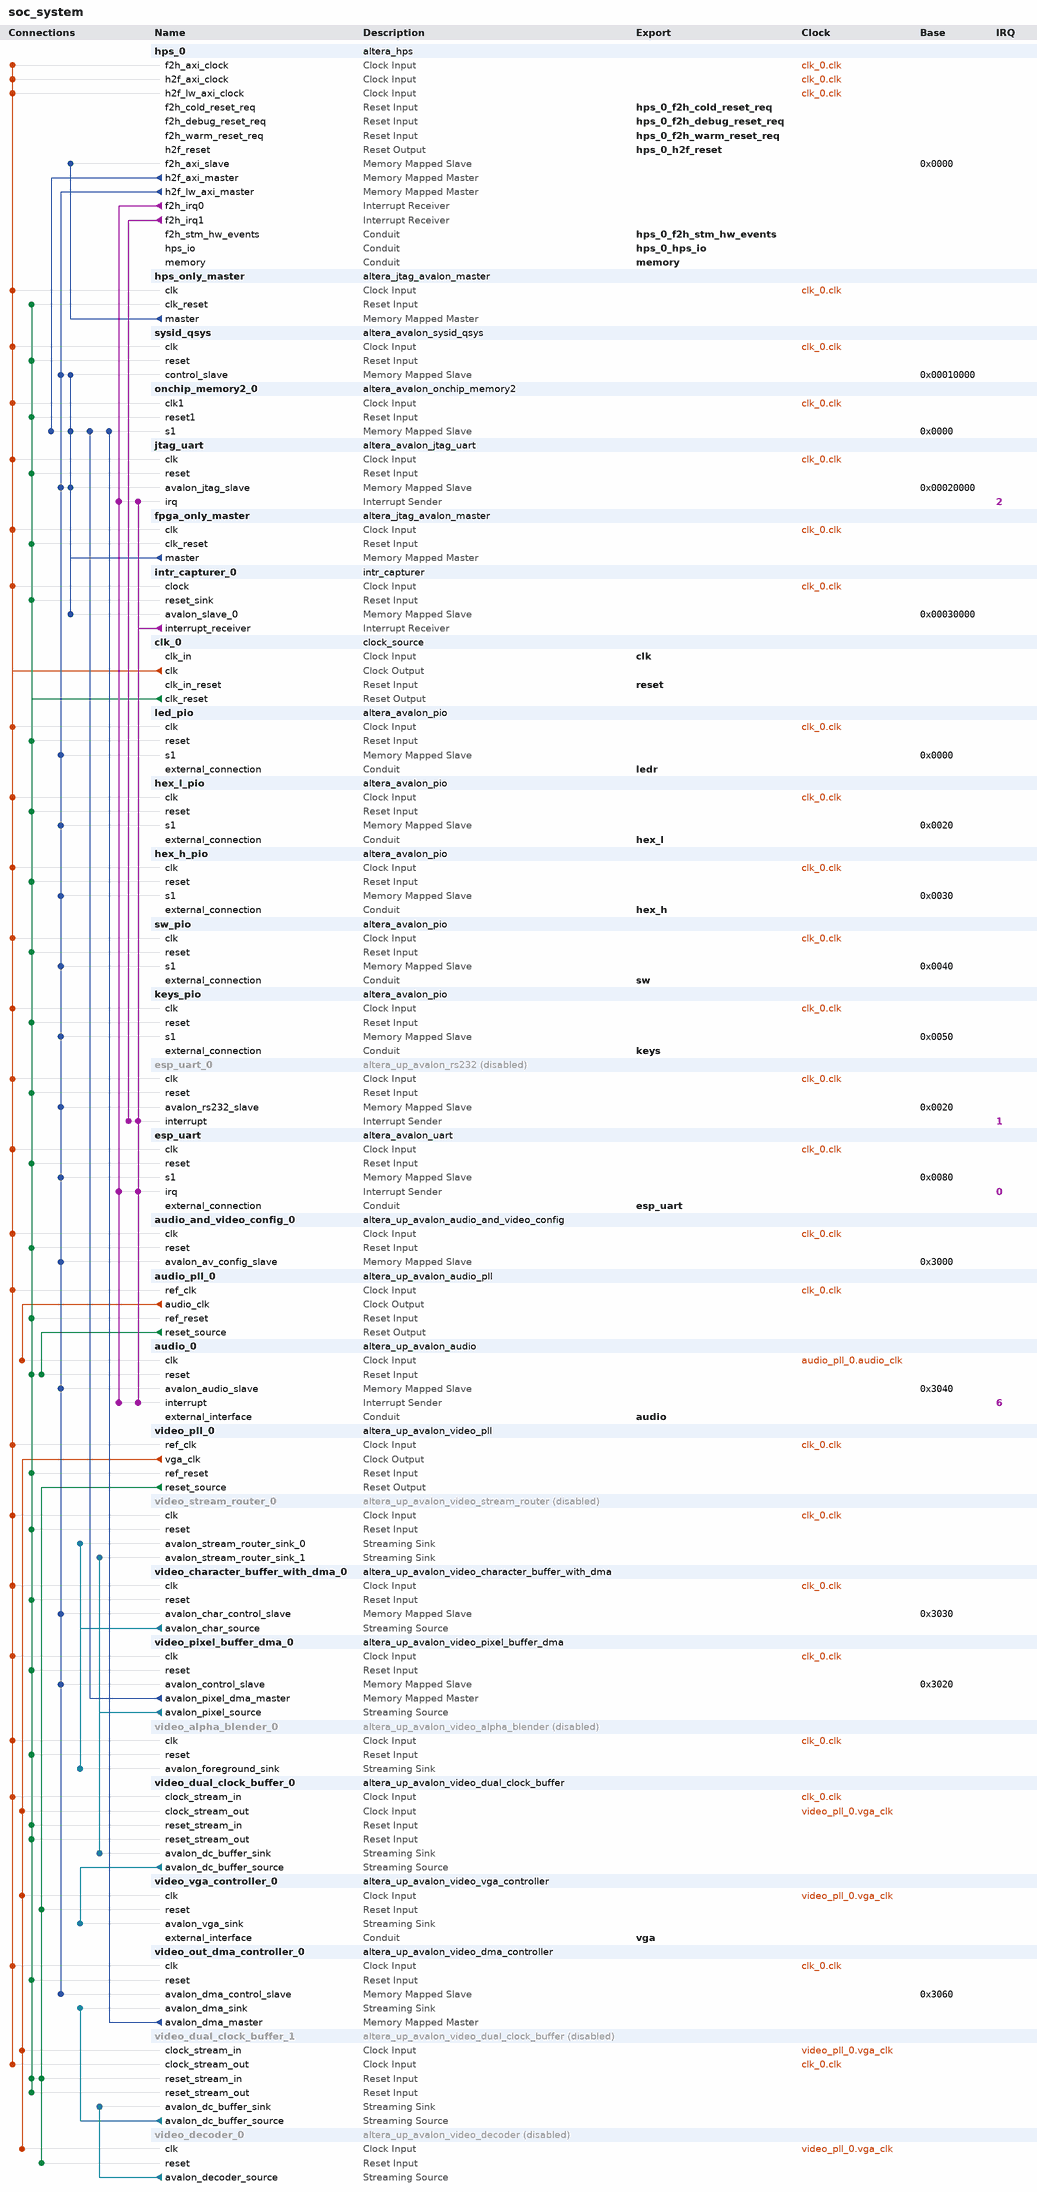
[diagram p0: system contents]
# Platform Designer (Qsys) system soc_system, Cyclone V 5CSEMA5F31C6
# Parameters at their usual value, and those the tool derives, are not listed.
package require -exact qsys 18.1
create_system soc_system
set_project_property DEVICE_FAMILY {Cyclone V}
set_project_property DEVICE 5CSEMA5F31C6

add_instance hps_0 altera_hps 18.1
set_instance_parameter_value hps_0 EMAC1_Mode RGMII
set_instance_parameter_value hps_0 EMAC1_PinMuxing {HPS I/O Set 0}
set_instance_parameter_value hps_0 F2SCLK_COLDRST_Enable true
set_instance_parameter_value hps_0 F2SCLK_DBGRST_Enable true
set_instance_parameter_value hps_0 F2SCLK_WARMRST_Enable true
set_instance_parameter_value hps_0 F2SINTERRUPT_Enable true
set_instance_parameter_value hps_0 F2S_Width 2
set_instance_parameter_value hps_0 FPGA_PERIPHERAL_OUTPUT_CLOCK_FREQ_EMAC0_GTX_CLK 100
set_instance_parameter_value hps_0 FPGA_PERIPHERAL_OUTPUT_CLOCK_FREQ_EMAC0_MD_CLK 100.0
set_instance_parameter_value hps_0 FPGA_PERIPHERAL_OUTPUT_CLOCK_FREQ_EMAC1_GTX_CLK 100
set_instance_parameter_value hps_0 FPGA_PERIPHERAL_OUTPUT_CLOCK_FREQ_EMAC1_MD_CLK 100.0
set_instance_parameter_value hps_0 HPS_PROTOCOL DDR3
set_instance_parameter_value hps_0 I2C0_Mode I2C
set_instance_parameter_value hps_0 I2C0_PinMuxing {HPS I/O Set 0}
set_instance_parameter_value hps_0 I2C1_Mode I2C
set_instance_parameter_value hps_0 I2C1_PinMuxing {HPS I/O Set 0}
set_instance_parameter_value hps_0 LWH2F_Enable true
set_instance_parameter_value hps_0 MEM_BANKADDR_WIDTH 3
set_instance_parameter_value hps_0 MEM_CLK_FREQ 400.0
set_instance_parameter_value hps_0 MEM_COL_ADDR_WIDTH 10
set_instance_parameter_value hps_0 MEM_DQ_WIDTH 32
set_instance_parameter_value hps_0 MEM_DRV_STR RZQ/7
set_instance_parameter_value hps_0 MEM_ROW_ADDR_WIDTH 15
set_instance_parameter_value hps_0 MEM_RTT_NOM RZQ/4
set_instance_parameter_value hps_0 MEM_RTT_WR RZQ/4
set_instance_parameter_value hps_0 MEM_TCL 11
set_instance_parameter_value hps_0 MEM_TFAW_NS 30.0
set_instance_parameter_value hps_0 MEM_TRAS_NS 35.0
set_instance_parameter_value hps_0 MEM_TRCD_NS 13.75
set_instance_parameter_value hps_0 MEM_TRFC_NS 260.0
set_instance_parameter_value hps_0 MEM_TRP_NS 13.75
set_instance_parameter_value hps_0 MEM_VENDOR JEDEC
set_instance_parameter_value hps_0 MEM_WTCL 8
set_instance_parameter_value hps_0 QSPI_Mode {1 SS}
set_instance_parameter_value hps_0 QSPI_PinMuxing {HPS I/O Set 0}
set_instance_parameter_value hps_0 REF_CLK_FREQ 25.0
set_instance_parameter_value hps_0 S2FCLK_USER2CLK 5
set_instance_parameter_value hps_0 S2F_Width 2
set_instance_parameter_value hps_0 SDIO_Mode {4-bit Data}
set_instance_parameter_value hps_0 SDIO_PinMuxing {HPS I/O Set 0}
set_instance_parameter_value hps_0 SPIM1_Mode {Single Slave Select}
set_instance_parameter_value hps_0 SPIM1_PinMuxing {HPS I/O Set 0}
set_instance_parameter_value hps_0 STM_Enable true
set_instance_parameter_value hps_0 TIMING_BOARD_AC_SKEW 0.03
set_instance_parameter_value hps_0 TIMING_BOARD_AC_TO_CK_SKEW 0.0
set_instance_parameter_value hps_0 TIMING_BOARD_DQ_TO_DQS_SKEW 0.0
set_instance_parameter_value hps_0 TIMING_BOARD_MAX_CK_DELAY 0.03
set_instance_parameter_value hps_0 TIMING_BOARD_MAX_DQS_DELAY 0.02
set_instance_parameter_value hps_0 TIMING_BOARD_SKEW_BETWEEN_DQS 0.08
set_instance_parameter_value hps_0 TIMING_BOARD_SKEW_CKDQS_DIMM_MAX 0.16
set_instance_parameter_value hps_0 TIMING_BOARD_SKEW_CKDQS_DIMM_MIN 0.09
set_instance_parameter_value hps_0 TIMING_BOARD_SKEW_WITHIN_DQS 0.01
set_instance_parameter_value hps_0 TIMING_TDH 65
set_instance_parameter_value hps_0 TIMING_TDQSCK 255
set_instance_parameter_value hps_0 TIMING_TDQSQ 125
set_instance_parameter_value hps_0 TIMING_TDS 30
set_instance_parameter_value hps_0 TIMING_TIH 140
set_instance_parameter_value hps_0 TIMING_TIS 180
set_instance_parameter_value hps_0 TIMING_TQSH 0.4
set_instance_parameter_value hps_0 UART0_Mode {No Flow Control}
set_instance_parameter_value hps_0 UART0_PinMuxing {HPS I/O Set 0}
set_instance_parameter_value hps_0 USB1_Mode SDR
set_instance_parameter_value hps_0 USB1_PinMuxing {HPS I/O Set 0}
set_instance_parameter_value hps_0 desired_cfg_clk_mhz 100.0
set_instance_parameter_value hps_0 desired_qspi_clk_mhz 400.0

add_instance hps_only_master altera_jtag_avalon_master 18.1

add_instance sysid_qsys altera_avalon_sysid_qsys 18.1
set_instance_parameter_value sysid_qsys id -1395322110

add_instance onchip_memory2_0 altera_avalon_onchip_memory2 18.1
set_instance_parameter_value onchip_memory2_0 dataWidth 64
set_instance_parameter_value onchip_memory2_0 dualPort false
set_instance_parameter_value onchip_memory2_0 initMemContent true
set_instance_parameter_value onchip_memory2_0 initializationFileName onchip_memory2_0
set_instance_parameter_value onchip_memory2_0 memorySize 65536

add_instance jtag_uart altera_avalon_jtag_uart 18.1
set_instance_parameter_value jtag_uart allowMultipleConnections true
set_instance_parameter_value jtag_uart simInteractiveOptions INTERACTIVE_ASCII_OUTPUT

add_instance fpga_only_master altera_jtag_avalon_master 18.1

add_instance intr_capturer_0 intr_capturer 100.99.98.97

add_instance clk_0 clock_source 18.1
set_instance_parameter_value clk_0 clockFrequency 50000000

add_instance led_pio altera_avalon_pio 18.1
set_instance_parameter_value led_pio direction Output
set_instance_parameter_value led_pio resetValue 15
set_instance_parameter_value led_pio width 10

add_instance hex_l_pio altera_avalon_pio 18.1
set_instance_parameter_value hex_l_pio direction Output
set_instance_parameter_value hex_l_pio width 21

add_instance hex_h_pio altera_avalon_pio 18.1
set_instance_parameter_value hex_h_pio direction Output
set_instance_parameter_value hex_h_pio width 21

add_instance sw_pio altera_avalon_pio 18.1
set_instance_parameter_value sw_pio bitClearingEdgeCapReg true
set_instance_parameter_value sw_pio captureEdge true
set_instance_parameter_value sw_pio direction Input
set_instance_parameter_value sw_pio edgeType ANY
set_instance_parameter_value sw_pio generateIRQ true
set_instance_parameter_value sw_pio irqType EDGE
set_instance_parameter_value sw_pio width 10

add_instance keys_pio altera_avalon_pio 18.1
set_instance_parameter_value keys_pio bitClearingEdgeCapReg true
set_instance_parameter_value keys_pio captureEdge true
set_instance_parameter_value keys_pio direction Input
set_instance_parameter_value keys_pio edgeType FALLING
set_instance_parameter_value keys_pio generateIRQ true
set_instance_parameter_value keys_pio irqType EDGE
set_instance_parameter_value keys_pio width 4

add_instance esp_uart_0 altera_up_avalon_rs232 17.1
set_instance_property esp_uart_0 ENABLED false
set_instance_parameter_value esp_uart_0 baud 115200
set_instance_parameter_value esp_uart_0 parity None

add_instance esp_uart altera_avalon_uart 18.1
set_instance_parameter_value esp_uart baud 115200
set_instance_parameter_value esp_uart dataBits 8
set_instance_parameter_value esp_uart fixedBaud true
set_instance_parameter_value esp_uart parity NONE
set_instance_parameter_value esp_uart stopBits 1

add_instance audio_and_video_config_0 altera_up_avalon_audio_and_video_config 18.0
set_instance_parameter_value audio_and_video_config_0 audio_in {Microphone to ADC}
set_instance_parameter_value audio_and_video_config_0 bit_length 24
set_instance_parameter_value audio_and_video_config_0 board DE1-SoC
set_instance_parameter_value audio_and_video_config_0 eai false
set_instance_parameter_value audio_and_video_config_0 line_in_bypass false
set_instance_parameter_value audio_and_video_config_0 sampling_rate {48 kHz}

add_instance audio_pll_0 altera_up_avalon_audio_pll 18.0
set_instance_parameter_value audio_pll_0 gui_refclk 50.0

add_instance audio_0 altera_up_avalon_audio 18.0
set_instance_parameter_value audio_0 audio_in false
set_instance_parameter_value audio_0 avalon_bus_type {Memory Mapped}
set_instance_parameter_value audio_0 dw 16

add_instance video_pll_0 altera_up_avalon_video_pll 18.0
set_instance_parameter_value video_pll_0 camera {5MP Digital Camera (THDB_D5M)}
set_instance_parameter_value video_pll_0 gui_refclk 50.0
set_instance_parameter_value video_pll_0 lcd {7" LCD on VEEK-MT and MTL/MTL2 Modules}

add_instance video_stream_router_0 altera_up_avalon_video_stream_router 18.0
set_instance_property video_stream_router_0 ENABLED false
set_instance_parameter_value video_stream_router_0 color_bits 8
set_instance_parameter_value video_stream_router_0 color_planes 1
set_instance_parameter_value video_stream_router_0 router_type Merge
set_instance_parameter_value video_stream_router_0 sync false

add_instance video_character_buffer_with_dma_0 altera_up_avalon_video_character_buffer_with_dma 18.0
set_instance_parameter_value video_character_buffer_with_dma_0 enable_transparency false

add_instance video_pixel_buffer_dma_0 altera_up_avalon_video_pixel_buffer_dma 18.0
set_instance_parameter_value video_pixel_buffer_dma_0 addr_mode X-Y
set_instance_parameter_value video_pixel_buffer_dma_0 back_start_address 0
set_instance_parameter_value video_pixel_buffer_dma_0 color_space {30-bit RGB}
set_instance_parameter_value video_pixel_buffer_dma_0 image_height 480
set_instance_parameter_value video_pixel_buffer_dma_0 image_width 640
set_instance_parameter_value video_pixel_buffer_dma_0 start_address 0

add_instance video_alpha_blender_0 altera_up_avalon_video_alpha_blender 18.0
set_instance_property video_alpha_blender_0 ENABLED false

add_instance video_dual_clock_buffer_0 altera_up_avalon_video_dual_clock_buffer 18.0
set_instance_parameter_value video_dual_clock_buffer_0 color_bits 10

add_instance video_vga_controller_0 altera_up_avalon_video_vga_controller 18.0
set_instance_parameter_value video_vga_controller_0 board DE1-SoC
set_instance_parameter_value video_vga_controller_0 resolution {VGA 640x480}

add_instance video_out_dma_controller_0 altera_up_avalon_video_dma_controller 18.0
set_instance_parameter_value video_out_dma_controller_0 addr_mode X-Y
set_instance_parameter_value video_out_dma_controller_0 back_start_address 0
set_instance_parameter_value video_out_dma_controller_0 color_bits 8
set_instance_parameter_value video_out_dma_controller_0 color_planes 3
set_instance_parameter_value video_out_dma_controller_0 dma_enabled true
set_instance_parameter_value video_out_dma_controller_0 height 240
set_instance_parameter_value video_out_dma_controller_0 mode {From Stream to Memory}
set_instance_parameter_value video_out_dma_controller_0 start_address 0
set_instance_parameter_value video_out_dma_controller_0 width 320

add_instance video_dual_clock_buffer_1 altera_up_avalon_video_dual_clock_buffer 18.0
set_instance_property video_dual_clock_buffer_1 ENABLED false
set_instance_parameter_value video_dual_clock_buffer_1 color_bits 8

add_instance video_decoder_0 altera_up_avalon_video_decoder 18.0
set_instance_property video_decoder_0 ENABLED false

# connections
add_connection audio_pll_0.audio_clk audio_0.clk clock
add_connection clk_0.clk audio_and_video_config_0.clk clock
add_connection clk_0.clk audio_pll_0.ref_clk clock
add_connection clk_0.clk esp_uart.clk clock
add_connection clk_0.clk esp_uart_0.clk clock
add_connection clk_0.clk fpga_only_master.clk clock
add_connection clk_0.clk hex_h_pio.clk clock
add_connection clk_0.clk hex_l_pio.clk clock
add_connection clk_0.clk hps_0.f2h_axi_clock clock
add_connection clk_0.clk hps_0.h2f_axi_clock clock
add_connection clk_0.clk hps_0.h2f_lw_axi_clock clock
add_connection clk_0.clk hps_only_master.clk clock
add_connection clk_0.clk intr_capturer_0.clock clock
add_connection clk_0.clk jtag_uart.clk clock
add_connection clk_0.clk keys_pio.clk clock
add_connection clk_0.clk led_pio.clk clock
add_connection clk_0.clk onchip_memory2_0.clk1 clock
add_connection clk_0.clk sw_pio.clk clock
add_connection clk_0.clk sysid_qsys.clk clock
add_connection clk_0.clk video_alpha_blender_0.clk clock
add_connection clk_0.clk video_character_buffer_with_dma_0.clk clock
add_connection clk_0.clk video_dual_clock_buffer_0.clock_stream_in clock
add_connection clk_0.clk video_dual_clock_buffer_1.clock_stream_out clock
add_connection clk_0.clk video_out_dma_controller_0.clk clock
add_connection clk_0.clk video_pixel_buffer_dma_0.clk clock
add_connection clk_0.clk video_pll_0.ref_clk clock
add_connection clk_0.clk video_stream_router_0.clk clock
add_connection video_pll_0.vga_clk video_decoder_0.clk clock
add_connection video_pll_0.vga_clk video_dual_clock_buffer_0.clock_stream_out clock
add_connection video_pll_0.vga_clk video_dual_clock_buffer_1.clock_stream_in clock
add_connection video_pll_0.vga_clk video_vga_controller_0.clk clock
add_connection audio_pll_0.reset_source audio_0.reset reset
add_connection clk_0.clk_reset audio_0.reset reset
add_connection clk_0.clk_reset audio_and_video_config_0.reset reset
add_connection clk_0.clk_reset audio_pll_0.ref_reset reset
add_connection clk_0.clk_reset esp_uart.reset reset
add_connection clk_0.clk_reset esp_uart_0.reset reset
add_connection clk_0.clk_reset fpga_only_master.clk_reset reset
add_connection clk_0.clk_reset hex_h_pio.reset reset
add_connection clk_0.clk_reset hex_l_pio.reset reset
add_connection clk_0.clk_reset hps_only_master.clk_reset reset
add_connection clk_0.clk_reset intr_capturer_0.reset_sink reset
add_connection clk_0.clk_reset jtag_uart.reset reset
add_connection clk_0.clk_reset keys_pio.reset reset
add_connection clk_0.clk_reset led_pio.reset reset
add_connection clk_0.clk_reset onchip_memory2_0.reset1 reset
add_connection clk_0.clk_reset sw_pio.reset reset
add_connection clk_0.clk_reset sysid_qsys.reset reset
add_connection clk_0.clk_reset video_alpha_blender_0.reset reset
add_connection clk_0.clk_reset video_character_buffer_with_dma_0.reset reset
add_connection clk_0.clk_reset video_dual_clock_buffer_0.reset_stream_in reset
add_connection clk_0.clk_reset video_dual_clock_buffer_0.reset_stream_out reset
add_connection clk_0.clk_reset video_dual_clock_buffer_1.reset_stream_in reset
add_connection clk_0.clk_reset video_dual_clock_buffer_1.reset_stream_out reset
add_connection clk_0.clk_reset video_out_dma_controller_0.reset reset
add_connection clk_0.clk_reset video_pixel_buffer_dma_0.reset reset
add_connection clk_0.clk_reset video_pll_0.ref_reset reset
add_connection clk_0.clk_reset video_stream_router_0.reset reset
add_connection video_pll_0.reset_source video_decoder_0.reset reset
add_connection video_pll_0.reset_source video_dual_clock_buffer_1.reset_stream_in reset
add_connection video_pll_0.reset_source video_vga_controller_0.reset reset
add_connection fpga_only_master.master intr_capturer_0.avalon_slave_0 avalon
set_connection_parameter_value fpga_only_master.master/intr_capturer_0.avalon_slave_0 baseAddress 0x00030000
add_connection fpga_only_master.master jtag_uart.avalon_jtag_slave avalon
set_connection_parameter_value fpga_only_master.master/jtag_uart.avalon_jtag_slave baseAddress 0x00020000
add_connection fpga_only_master.master onchip_memory2_0.s1 avalon
set_connection_parameter_value fpga_only_master.master/onchip_memory2_0.s1 baseAddress 0x0000
add_connection fpga_only_master.master sysid_qsys.control_slave avalon
set_connection_parameter_value fpga_only_master.master/sysid_qsys.control_slave baseAddress 0x00010000
add_connection hps_0.h2f_axi_master onchip_memory2_0.s1 avalon
set_connection_parameter_value hps_0.h2f_axi_master/onchip_memory2_0.s1 baseAddress 0x0000
add_connection hps_0.h2f_lw_axi_master audio_0.avalon_audio_slave avalon
set_connection_parameter_value hps_0.h2f_lw_axi_master/audio_0.avalon_audio_slave baseAddress 0x3040
add_connection hps_0.h2f_lw_axi_master audio_and_video_config_0.avalon_av_config_slave avalon
set_connection_parameter_value hps_0.h2f_lw_axi_master/audio_and_video_config_0.avalon_av_config_slave baseAddress 0x3000
add_connection hps_0.h2f_lw_axi_master esp_uart.s1 avalon
set_connection_parameter_value hps_0.h2f_lw_axi_master/esp_uart.s1 baseAddress 0x0080
add_connection hps_0.h2f_lw_axi_master esp_uart_0.avalon_rs232_slave avalon
set_connection_parameter_value hps_0.h2f_lw_axi_master/esp_uart_0.avalon_rs232_slave baseAddress 0x0020
add_connection hps_0.h2f_lw_axi_master hex_h_pio.s1 avalon
set_connection_parameter_value hps_0.h2f_lw_axi_master/hex_h_pio.s1 baseAddress 0x0030
add_connection hps_0.h2f_lw_axi_master hex_l_pio.s1 avalon
set_connection_parameter_value hps_0.h2f_lw_axi_master/hex_l_pio.s1 baseAddress 0x0020
add_connection hps_0.h2f_lw_axi_master jtag_uart.avalon_jtag_slave avalon
set_connection_parameter_value hps_0.h2f_lw_axi_master/jtag_uart.avalon_jtag_slave baseAddress 0x00020000
add_connection hps_0.h2f_lw_axi_master keys_pio.s1 avalon
set_connection_parameter_value hps_0.h2f_lw_axi_master/keys_pio.s1 baseAddress 0x0050
add_connection hps_0.h2f_lw_axi_master led_pio.s1 avalon
set_connection_parameter_value hps_0.h2f_lw_axi_master/led_pio.s1 baseAddress 0x0000
add_connection hps_0.h2f_lw_axi_master sw_pio.s1 avalon
set_connection_parameter_value hps_0.h2f_lw_axi_master/sw_pio.s1 baseAddress 0x0040
add_connection hps_0.h2f_lw_axi_master sysid_qsys.control_slave avalon
set_connection_parameter_value hps_0.h2f_lw_axi_master/sysid_qsys.control_slave baseAddress 0x00010000
add_connection hps_0.h2f_lw_axi_master video_character_buffer_with_dma_0.avalon_char_control_slave avalon
set_connection_parameter_value hps_0.h2f_lw_axi_master/video_character_buffer_with_dma_0.avalon_char_control_slave baseAddress 0x3030
add_connection hps_0.h2f_lw_axi_master video_out_dma_controller_0.avalon_dma_control_slave avalon
set_connection_parameter_value hps_0.h2f_lw_axi_master/video_out_dma_controller_0.avalon_dma_control_slave baseAddress 0x3060
add_connection hps_0.h2f_lw_axi_master video_pixel_buffer_dma_0.avalon_control_slave avalon
set_connection_parameter_value hps_0.h2f_lw_axi_master/video_pixel_buffer_dma_0.avalon_control_slave baseAddress 0x3020
add_connection hps_only_master.master hps_0.f2h_axi_slave avalon
set_connection_parameter_value hps_only_master.master/hps_0.f2h_axi_slave baseAddress 0x0000
add_connection video_out_dma_controller_0.avalon_dma_master onchip_memory2_0.s1 avalon
set_connection_parameter_value video_out_dma_controller_0.avalon_dma_master/onchip_memory2_0.s1 baseAddress 0x0000
add_connection video_pixel_buffer_dma_0.avalon_pixel_dma_master onchip_memory2_0.s1 avalon
set_connection_parameter_value video_pixel_buffer_dma_0.avalon_pixel_dma_master/onchip_memory2_0.s1 baseAddress 0x0000
add_connection video_character_buffer_with_dma_0.avalon_char_source video_alpha_blender_0.avalon_foreground_sink avalon_streaming
add_connection video_character_buffer_with_dma_0.avalon_char_source video_stream_router_0.avalon_stream_router_sink_0 avalon_streaming
add_connection video_decoder_0.avalon_decoder_source video_dual_clock_buffer_1.avalon_dc_buffer_sink avalon_streaming
add_connection video_dual_clock_buffer_0.avalon_dc_buffer_source video_vga_controller_0.avalon_vga_sink avalon_streaming
add_connection video_dual_clock_buffer_1.avalon_dc_buffer_source video_out_dma_controller_0.avalon_dma_sink avalon_streaming
add_connection video_pixel_buffer_dma_0.avalon_pixel_source video_dual_clock_buffer_0.avalon_dc_buffer_sink avalon_streaming
add_connection video_pixel_buffer_dma_0.avalon_pixel_source video_stream_router_0.avalon_stream_router_sink_1 avalon_streaming
add_connection hps_0.f2h_irq0 audio_0.interrupt interrupt
set_connection_parameter_value hps_0.f2h_irq0/audio_0.interrupt irqNumber 6
add_connection hps_0.f2h_irq0 esp_uart.irq interrupt
set_connection_parameter_value hps_0.f2h_irq0/esp_uart.irq irqNumber 0
add_connection hps_0.f2h_irq0 jtag_uart.irq interrupt
set_connection_parameter_value hps_0.f2h_irq0/jtag_uart.irq irqNumber 2
add_connection hps_0.f2h_irq1 esp_uart_0.interrupt interrupt
set_connection_parameter_value hps_0.f2h_irq1/esp_uart_0.interrupt irqNumber 1
add_connection intr_capturer_0.interrupt_receiver audio_0.interrupt interrupt
set_connection_parameter_value intr_capturer_0.interrupt_receiver/audio_0.interrupt irqNumber 6
add_connection intr_capturer_0.interrupt_receiver esp_uart.irq interrupt
set_connection_parameter_value intr_capturer_0.interrupt_receiver/esp_uart.irq irqNumber 0
add_connection intr_capturer_0.interrupt_receiver esp_uart_0.interrupt interrupt
set_connection_parameter_value intr_capturer_0.interrupt_receiver/esp_uart_0.interrupt irqNumber 1
add_connection intr_capturer_0.interrupt_receiver jtag_uart.irq interrupt
set_connection_parameter_value intr_capturer_0.interrupt_receiver/jtag_uart.irq irqNumber 2

# exported interfaces
add_interface audio conduit end
set_interface_property audio EXPORT_OF audio_0.external_interface
add_interface clk clock sink
set_interface_property clk EXPORT_OF clk_0.clk_in
add_interface esp_uart conduit end
set_interface_property esp_uart EXPORT_OF esp_uart.external_connection
add_interface hex_h conduit end
set_interface_property hex_h EXPORT_OF hex_h_pio.external_connection
add_interface hex_l conduit end
set_interface_property hex_l EXPORT_OF hex_l_pio.external_connection
add_interface hps_0_f2h_cold_reset_req reset sink
set_interface_property hps_0_f2h_cold_reset_req EXPORT_OF hps_0.f2h_cold_reset_req
add_interface hps_0_f2h_debug_reset_req reset sink
set_interface_property hps_0_f2h_debug_reset_req EXPORT_OF hps_0.f2h_debug_reset_req
add_interface hps_0_f2h_stm_hw_events conduit end
set_interface_property hps_0_f2h_stm_hw_events EXPORT_OF hps_0.f2h_stm_hw_events
add_interface hps_0_f2h_warm_reset_req reset sink
set_interface_property hps_0_f2h_warm_reset_req EXPORT_OF hps_0.f2h_warm_reset_req
add_interface hps_0_h2f_reset reset source
set_interface_property hps_0_h2f_reset EXPORT_OF hps_0.h2f_reset
add_interface hps_0_hps_io conduit end
set_interface_property hps_0_hps_io EXPORT_OF hps_0.hps_io
add_interface keys conduit end
set_interface_property keys EXPORT_OF keys_pio.external_connection
add_interface ledr conduit end
set_interface_property ledr EXPORT_OF led_pio.external_connection
add_interface memory conduit end
set_interface_property memory EXPORT_OF hps_0.memory
add_interface reset reset sink
set_interface_property reset EXPORT_OF clk_0.clk_in_reset
add_interface sw conduit end
set_interface_property sw EXPORT_OF sw_pio.external_connection
add_interface vga conduit end
set_interface_property vga EXPORT_OF video_vga_controller_0.external_interface

set_interconnect_requirement {$system} qsys_mm.clockCrossingAdapter HANDSHAKE
set_interconnect_requirement {$system} qsys_mm.maxAdditionalLatency 1

save_system soc_system.qsys
